# EAGLE design dms_sensor_board (EAGLE 6.5.0)
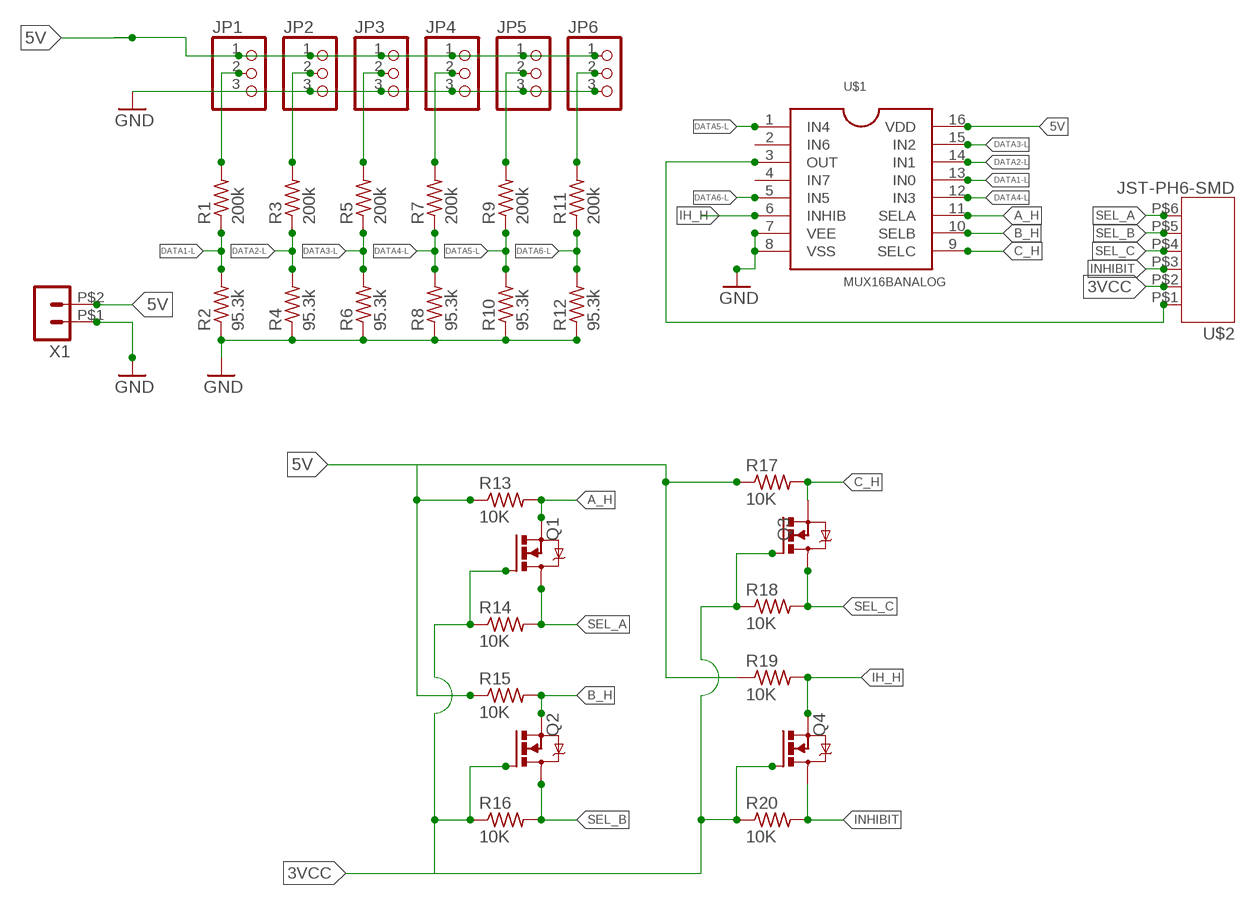
[diagram p0: schematic, sheet 1]

## Parts
JP1  PINHD-1X03_2.00  [1X03M]
JP2  PINHD-1X03_2.00  [1X03M]
JP3  PINHD-1X03_2.00  [1X03M]
JP4  PINHD-1X03_2.00  [1X03M]
JP5  PINHD-1X03_2.00  [1X03M]
JP6  PINHD-1X03_2.00  [1X03M]
Q1  IRLML5203  [MICRO3]
Q2  IRLML5203  [MICRO3]
Q3  IRLML5203  [MICRO3]
Q4  IRLML5203  [MICRO3]
R1  200k  R-US_R0805  [R0805]
R2  95.3k  R-US_R0805  [R0805]
R3  200k  R-US_R0805  [R0805]
R4  95.3k  R-US_R0805  [R0805]
R5  200k  R-US_R0805  [R0805]
R6  95.3k  R-US_R0805  [R0805]
R7  200k  R-US_R0805  [R0805]
R8  95.3k  R-US_R0805  [R0805]
R9  200k  R-US_R0805  [R0805]
R10  95.3k  R-US_R0805  [R0805]
R11  200k  R-US_R0805  [R0805]
R12  95.3k  R-US_R0805  [R0805]
R13  10K  R-US_R0805  [R0805]
R14  10K  R-US_R0805  [R0805]
R15  10K  R-US_R0805  [R0805]
R16  10K  R-US_R0805  [R0805]
R17  10K  R-US_R0805  [R0805]
R18  10K  R-US_R0805  [R0805]
R19  10K  R-US_R0805  [R0805]
R20  10K  R-US_R0805  [R0805]
U$1  MUX16BANALOG  [SO16]
U$2  JST-PH6-SMD  [JST-PH6-SMD]
X1  HEADER_POS2_43045-0206  [43045-0206]

## Nets
3VCC: Q1.1(G) Q2.1(G) Q3.1(G) Q4.1(G) R14.1 R16.1 R18.1 R20.1 U$2.P$2
5V [power]: JP1.1 JP2.1 JP3.1 JP4.1 JP5.1 JP6.1 R13.1 R15.1 R17.1 R19.1 U$1.16(VDD) X1.P$2
A_H: Q1.2(S) R13.2 U$1.11(SELA)
B_H: Q2.2(S) R15.2 U$1.10(SELB)
C_H: Q3.2(S) R17.2 U$1.9(SELC)
DATA1-H: JP1.2 R1.2
DATA1-L: R1.1 R2.2 U$1.13(IN0)
DATA2-H: JP2.2 R3.2
DATA2-L: R3.1 R4.2 U$1.14(IN1)
DATA3-H: JP3.2 R5.2
DATA3-L: R5.1 R6.2 U$1.15(IN2)
DATA4-H: JP4.2 R7.2
DATA4-L: R7.1 R8.2 U$1.12(IN3)
DATA5-H: JP5.2 R9.2
DATA5-L: R9.1 R10.2 U$1.1(IN4)
DATA6-H: JP6.2 R11.2
DATA6-L: R11.1 R12.2 U$1.5(IN5)
GND [power]: JP1.3 JP2.3 JP3.3 JP4.3 JP5.3 JP6.3 R2.1 R4.1 R6.1 R8.1 R10.1 R12.1 U$1.7(VEE) U$1.8(VSS) X1.P$1
IH_H: Q4.2(S) R19.2 U$1.6(INHIB)
INHIBIT: Q4.3(D) R20.2 U$2.P$3
N$5: U$1.3(OUT) U$2.P$1
SEL_A: Q1.3(D) R14.2 U$2.P$6
SEL_B: Q2.3(D) R16.2 U$2.P$5
SEL_C: Q3.3(D) R18.2 U$2.P$4
Unconnected: U$1.2(IN6) U$1.4(IN7)

## Library data of the parts
JP1-JP6 = pinhead-2:PINHD-1X03: PIN HEADER
Q1-Q4 = ngohara_parts:IRLML5203: BSS138 N-Channel Power MOSFET
R1-R20 = resistor:R-US_: RESISTOR, American symbol
U$1 = wolfbot_specific_parts:MUX16BANALOG: CD4051B 16 bit analog mux http://www.ti.com/lit/ds/symlink/cd4051b.pdf
U$2 = jst-ph:JST-PH6-SMD: JST-PH6-SMD surface mounted 6 pin straight PH connector http://www.jst-mfg.com/product/pdf/eng/ePH.pdf
X1 = con-molex-micro-fit-3_0:HEADER_POS2_?: Molex - Micro-Fit 3.0 Series connector, 3.00mm (0.118") pitch header, 2 positions.

## Net classes
0 default: width 0.381 mm, drill 0.508 mm, clearance 0.254 mm
1 power: width 0.635 mm, drill 0.508 mm, clearance 0.508 mm

## Board
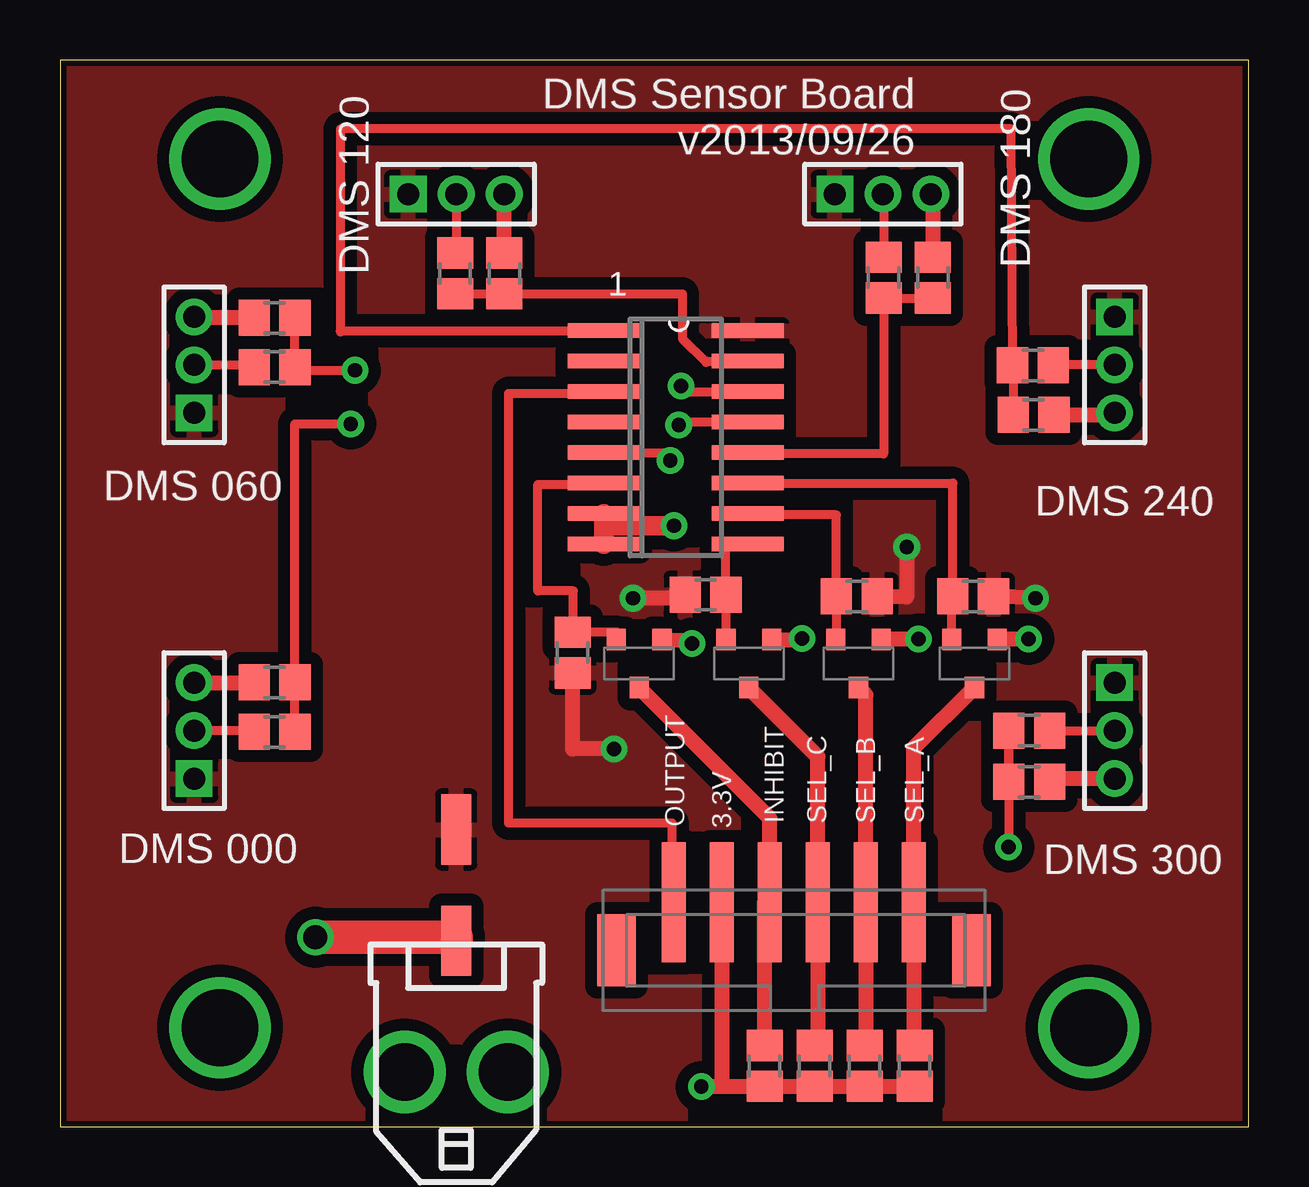
[diagram p1: board, top side]
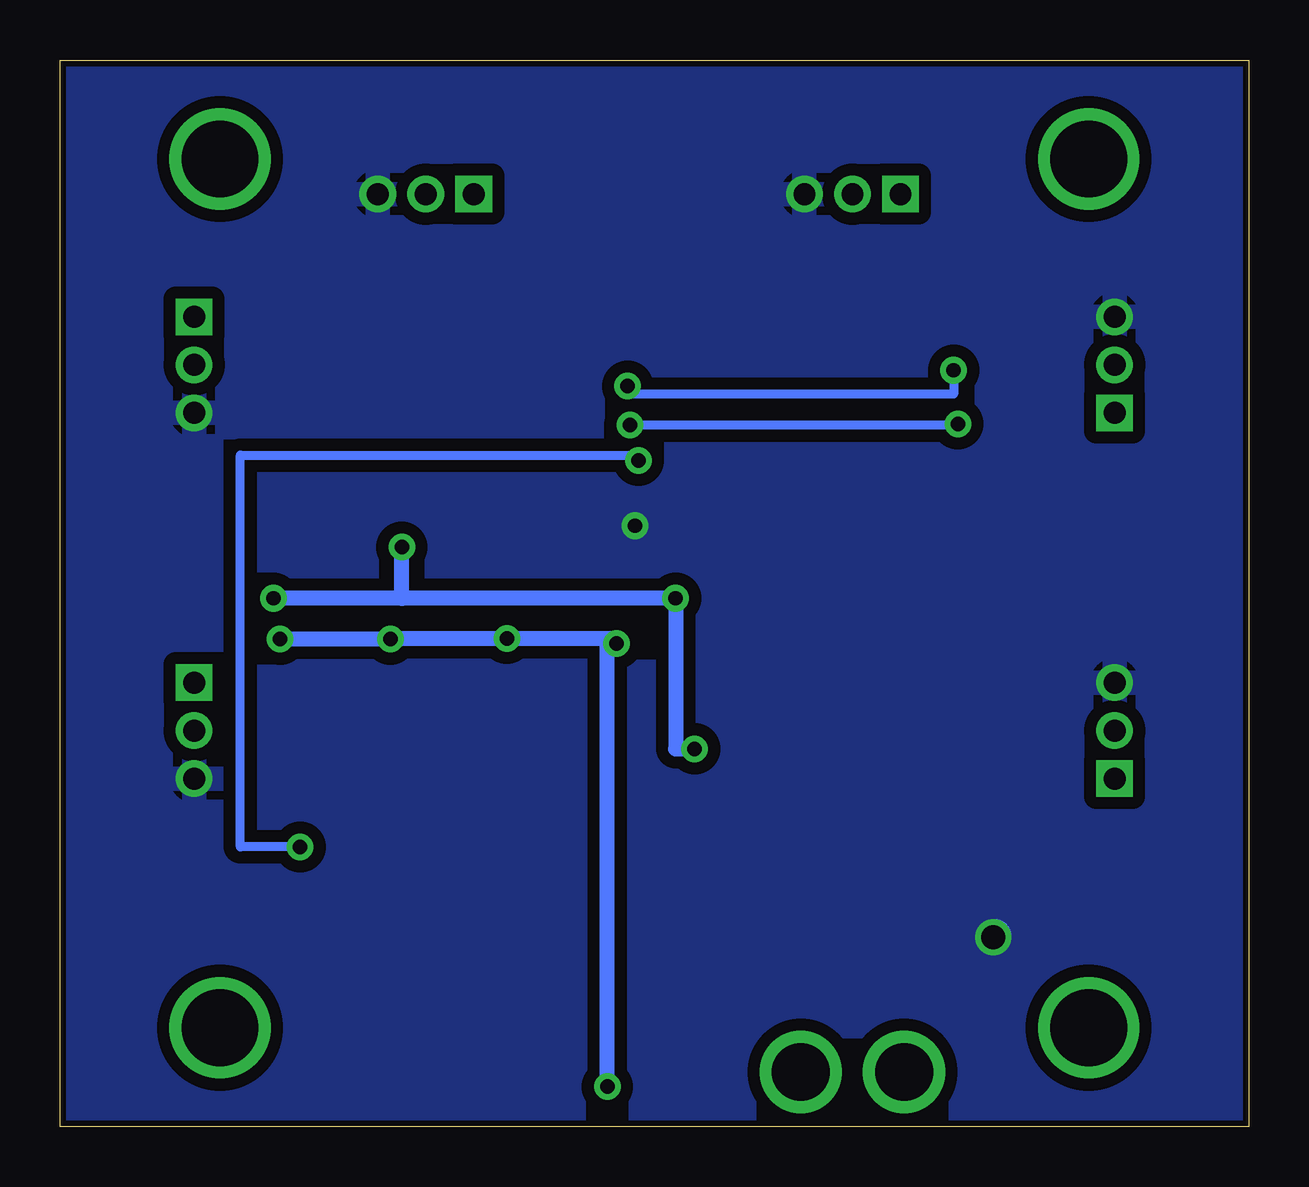
[diagram p2: board, bottom side, seen from below]

Size 49.53 x 44.45 mm. Coordinates in mm from the lower left corner, seen from the top.
Outline: 0,0 49.53,0 49.53,44.45 0,44.45 0,0
Copper layers (1*16): Top 0.035mm / dielectric 1.5mm / Bottom 0.035mm
Design rules "SparkFun": minimum track width 8mil, minimum drill 20mil, track to track 8mil, track to pad 8mil, pad to pad 8mil, via to via 8mil, smd to smd 8mil, copper to edge 10mil, drill to drill 8mil, minimum pad ring 12mil, minimum via ring 10mil, stop-mask expansion 4mil, vias tented up to drill 25mil, thermal gap 10mil

### Footprints (pad centres in the part's own frame; a part is rotated, then mirrored left to right if it is on the bottom)
1X03M = drill 0.914 square: 1 -2,0 | drill 0.914: 2 0,0; 3 2,0
MICRO3 = smd 0.8 x 0.9: 1 -0.95,-1; 2 0.95,-1; 3 0,1
R0805 = smd 1.3 x 1.5: 1 -0.85,0; 2 0.85,0
SO16 = smd 0.6 x 3: 1 -4.445,-3; 2 -3.175,-3; 3 -1.905,-3; 4 -0.635,-3; 5 0.635,-3; 6 1.905,-3; 7 3.175,-3; 8 4.445,-3; 9 4.445,3; 10 3.175,3; 11 1.905,3; 12 0.635,3; 13 -0.635,3; 14 -1.905,3; 15 -3.175,3; 16 -4.445,3
JST-PH6-SMD = smd 1 x 5: P$1 2.975,4.5; P$2 4.975,4.5; P$3 6.975,4.5; P$4 8.975,4.5; P$5 10.975,4.5; P$6 12.975,4.5 | smd 1.6 x 3: P$7 0.575,2.5; P$8 15.375,2.5
43045-0206 = smd 1.27 x 2.92: P$1 0,5.47; P$2 0,10.1 | drill 2.41: P$3 -2.15,0; P$4 2.15,0

### Placement (x,y rotation side)
JP1  5.59,16.51 90 top
JP2  5.59,31.75 90 top
JP3  16.51,38.86 0 top
JP4  34.29,38.86 0 top
JP5  43.94,31.75 270 top
JP6  43.94,16.51 270 top
Q1  38.1,19.3 180 top
Q2  33.27,19.3 180 top
Q3  28.7,19.3 180 top
Q4  24.13,19.3 180 top
R1  8.94,16.46 180 top
R2  8.94,18.52 0 top
R3  8.94,31.65 180 top
R4  8.94,33.71 0 top
R5  16.46,35.56 90 top
R6  18.52,35.56 270 top
R7  34.32,35.38 90 top
R8  36.37,35.38 270 top
R9  40.54,31.72 0 top
R10  40.56,29.67 180 top
R11  40.39,16.51 0 top
R12  40.39,14.38 180 top
R13  38.05,22.1 180 top
R14  35.61,2.54 90 top
R15  33.2,22.1 180 top
R16  33.53,2.54 90 top
R17  26.9,22.17 0 top
R18  31.45,2.54 90 top
R19  21.36,19.76 90 top
R20  29.36,2.54 90 top
U$1  25.65,28.73 270 top
U$2  22.61,4.85 0 top
X1  16.51,2.29 0 top

### Tracks (layer width: path | path; a pad name or v marks a point on that pad's centre or on a via)
3VCC  (via drill 0.6)
  Top 0.635: R14.1 R16.1 R18.1 R20.1 27.58,1.69 U$2.P$2 27.58,1.68 v26.72,1.68 | Q4.1 26.36,20.28 v26.34,20.14 | Q3.1 30.91,20.3 v30.91,20.34 | v35.76,20.32 34.22,20.32 Q2.1 | v40.36,20.32 39.05,20.32 Q1.1
  Bottom 0.635: 26.72,20.34 26.34,20.34 v26.34,20.14 26.72,20.34 | 26.72,20.34 v30.91,20.34 35.76,20.34 v35.76,20.32 v40.36,20.32 | v26.72,1.68 26.72,20.34
5V  (via drill 0.6)
  Top 0.635: R17.1 26.09,22.17 26.09,22.02 v23.88,22.02 | v35.28,24.16 35.28,22.07 R15.1 | v40.64,22.02 40.72,22.02 R13.1 | v23.09,15.75 21.36,15.75 R19.1
  Bottom 0.635: 35.28,22.02 v23.88,22.02 23.88,15.75 v23.09,15.75 | 35.28,22.02 v35.28,24.16 | 35.28,22.02 v40.64,22.02
  pour Top: -0.89,45.64 51.1,45.64 51.1,-1.88 -0.89,-1.88
A_H
  Top 0.381: Q1.2 37.15,22 R13.2 37.2,26.82 U$1.11
B_H
  Top 0.381: Q2.2 32.35,20.3 R15.2 32.35,25.5 28.65,25.5 U$1.10
C_H
  Top 0.381: Q3.2 R17.2 27.75,24.23 28.65,24.23 U$1.9
DATA1-H
  Top 0.381: R1.2 8.1,16.46 8.1,16.51 JP1.2
DATA1-L  (via drill 0.6)
  Top 0.381: R1.1 R2.2 9.79,29.29 v12.12,29.29 | 25.78,29.31 v25.78,29.23 25.78,29.36 U$1.13
  Bottom 0.381: v12.12,29.29 12.12,29.23 v25.78,29.23
DATA2-H
  Top 0.381: JP2.2 8.09,31.75 R3.2
DATA2-L  (via drill 0.6)
  Top 0.381: R4.2 R3.1 9.79,31.52 v12.29,31.52 | 25.88,30.58 v25.88,30.86 25.88,30.63 U$1.14
  Bottom 0.381: v12.29,31.52 12.29,30.53 25.88,30.53 v25.88,30.86
DATA3-H
  Top 0.381: JP3.2 16.51,36.41 R5.2
DATA3-L
  Top 0.381: R5.1 R6.2 25.93,34.71 25.93,32.84 26.92,31.85 26.92,31.9 U$1.15
DATA4-H
  Top 0.381: JP4.2 34.31,38.86 R7.2
DATA4-L
  Top 0.381: R8.2 R7.1 34.31,28.04 28.65,28.04 U$1.12
DATA5-H
  Top 0.381: JP5.2 41.39,31.75 R9.2
DATA5-L
  Top 0.381: R10.2 39.71,31.73 R9.1 39.64,41.58 11.68,41.58 11.68,33.17 | 11.68,33.12 11.68,33.17 | 11.68,33.17 U$1.1
DATA6-H
  Top 0.381: R11.2 JP6.2
DATA6-L  (via drill 0.6)
  Top 0.381: R12.2 R11.1 39.52,16.51 v39.52,11.66 | 25.43,28.04 v25.43,27.76 25.43,28.09 U$1.5
  Bottom 0.381: v39.52,11.66 42.01,11.66 42.01,27.99 25.43,27.99 v25.43,27.76
GND  (via drill 0.6, 1)
  Top 0.635: R4.1 5.59,33.71 JP2.3 | R6.1 JP3.3 | JP4.3 36.37,38.86 R8.1 | R10.1 43.94,29.67 JP5.3 | JP1.3 R2.1 | JP6.3 41.24,14.51 R12.1
  Top 0.813: U$1.8 U$1.7 22.65,25.04 v25.58,25.04
  Top 1.397: X1.P$1 16.51,7.9 v10.64,7.9
  Bottom 1.397: v10.64,7.9 10.64,7.95 10.59,7.95
  pour Bottom: 49.66,44.45 49.66,-0.08 0.03,-0.08 0.03,44.53
HOLE1  (via drill 3.2)
  other vias: 6.67,40.32
HOLE2  (via drill 3.2)
  other vias: 42.86,40.32
HOLE3  (via drill 3.2)
  other vias: 42.86,4.13
HOLE4  (via drill 3.2)
  other vias: 6.67,4.13
IH_H
  Top 0.381: Q4.2 23.18,20.61 21.39,20.61 | R19.2 21.39,20.61 | 21.39,20.61 21.39,22.33 19.91,22.33 19.91,26.77 22.65,26.77 U$1.6
INHIBIT
  Top 0.635: R20.2 29.36,9.35 U$2.P$3 29.58,12.85 Q4.3
N$5
  Top 0.381: U$2.P$1 25.5,9.35 25.5,12.65 18.69,12.65 18.69,30.56 22.65,30.56 | 23.03,30.56 22.99,30.56 22.65,30.56 | U$1.3 22.65,30.56
SEL_A
  Top 0.635: R14.2 35.58,3.39 U$2.P$6 35.58,15.79 Q1.3
SEL_B
  Top 0.635: R16.2 33.58,3.39 U$2.P$5 33.58,18 Q2.3
SEL_C
  Top 0.635: R18.2 31.58,3.39 U$2.P$4 31.58,15.43 Q3.3

### Text on the board
tPlace: DMS 120 | DMS 180 | DMS 060 | DMS 240 | DMS 000 | DMS 300
tNames: DMS Sensor Board / v2013/09/26 | 1 | INHIBIT | SEL_C | SEL_B | SEL_A | OUTPUT | 3.3V